# EAGLE design saa1064 (EAGLE 6.2)
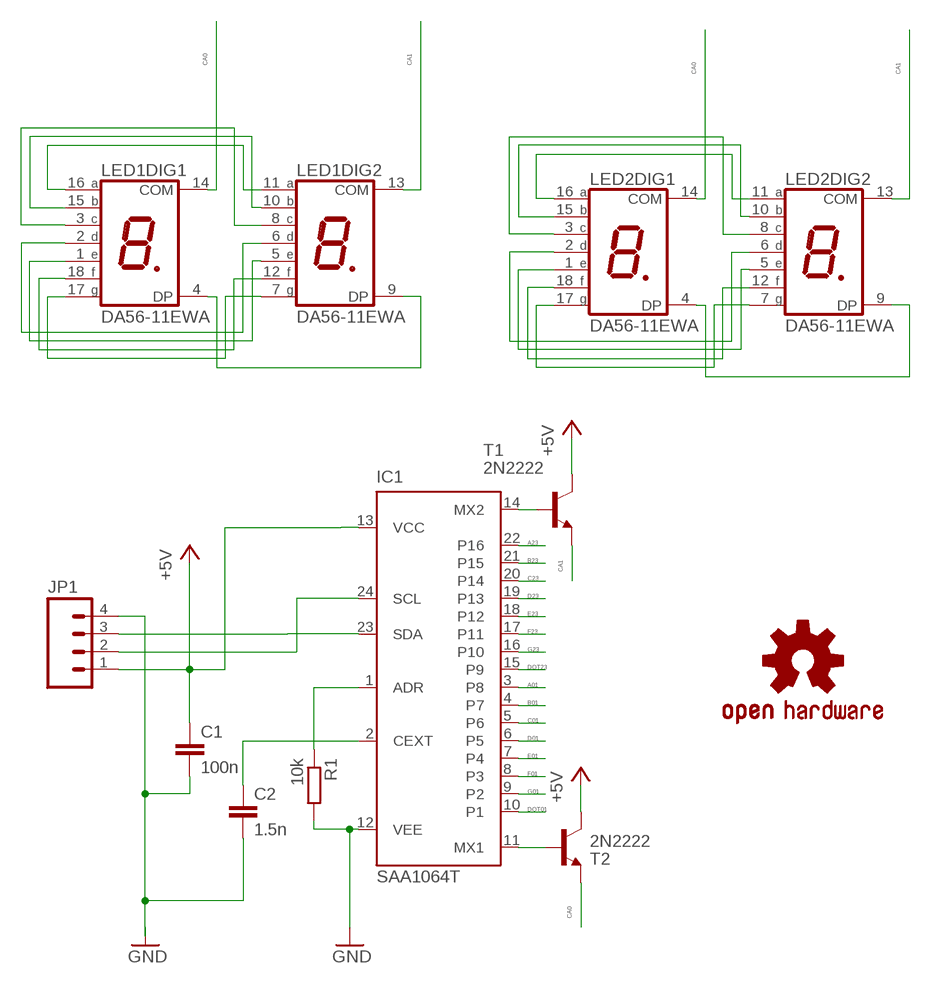
[diagram p0: schematic, sheet 1]

## Parts
C1  100n  C-EUC0805K  [C0805K]
C2  1.5n  C-EUC0805K  [C0805K]
IC1  SAA1064T  [SO24]
JP1  M04LONGPADS  [1X04_LONGPADS]
LED1  DA56-11EWA  [DA56]
LED2  DA56-11EWA  [DA56]
R1  10k  R-EU_M0805  [M0805]
T1  2N2222  [TO92-EBC-OVAL]
T2  2N2222  [TO92-EBC-OVAL]
U$1  OSHW-LOGOS  [OSHW-LOGO-S]

## Nets
+5V: C1.1 IC1.13(VCC) JP1.1 T1.C T2.C
A01: IC1.3(P8) LED1.11(DIG2:A) LED1.16(DIG1:A)
A23: IC1.22(P16) LED2.11(DIG2:A) LED2.16(DIG1:A)
B01: IC1.4(P7) LED1.10(DIG2:B) LED1.15(DIG1:B)
B23: IC1.21(P15) LED2.10(DIG2:B) LED2.15(DIG1:B)
C01: IC1.5(P6) LED1.3(DIG1:C) LED1.8(DIG2:C)
C23: IC1.20(P14) LED2.3(DIG1:C) LED2.8(DIG2:C)
CA0: LED1.14(DIG1:COM) LED2.14(DIG1:COM) T2.E
CA1: LED1.13(DIG2:COM) LED2.13(DIG2:COM) T1.E
D01: IC1.6(P5) LED1.2(DIG1:D) LED1.6(DIG2:D)
D23: IC1.19(P13) LED2.2(DIG1:D) LED2.6(DIG2:D)
DOT01: IC1.10(P1) LED1.4(DIG1:DP) LED1.9(DIG2:DP)
DOT23: IC1.15(P9) LED2.4(DIG1:DP) LED2.9(DIG2:DP)
E01: IC1.7(P4) LED1.1(DIG1:E) LED1.5(DIG2:E)
E23: IC1.18(P12) LED2.1(DIG1:E) LED2.5(DIG2:E)
F01: IC1.8(P3) LED1.12(DIG2:F) LED1.18(DIG1:F)
F23: IC1.17(P11) LED2.12(DIG2:F) LED2.18(DIG1:F)
G01: IC1.9(P2) LED1.7(DIG2:G) LED1.17(DIG1:G)
G23: IC1.16(P10) LED2.7(DIG2:G) LED2.17(DIG1:G)
GND: C1.2 C2.2 IC1.12(VEE) JP1.4 R1.2
N$1: IC1.1(ADR) R1.1
N$2: C2.1 IC1.2(CEXT)
N$15: IC1.11(MX1) T2.B
N$16: IC1.14(MX2) T1.B
SCL: IC1.24(SCL) JP1.2
SDA: IC1.23(SDA) JP1.3

## Library data of the parts
C1 C2 = resistor:C-EU: CAPACITOR, European symbol
IC1 = micro-philips:SAA1064: I2C-Bus 4-digit LED-DRIVER; MPN: SAA1064T/N2,118; OC_FARNELL: unknown; OC_NEWARK: 70R8648
JP1 = SparkFun:M04: Header 4 Standard 4-pin 0.1" header. Use with straight break away headers (SKU : PRT-00116), right angle break away headers (PRT-00553), swiss pins (PRT-00743), machine pins (PRT-00117), and female headers (PRT-00115). Molex polarized connector foot print use with SKU : PRT-08231 with associated crimp pins and housings. 1MM SMD Version SKU: PRT-10208
LED1 LED2 = display-kingbright:DA56-11: 14.22mm (0.56INCH) DUAL DIGIT NUMERIC DISPLAYS Source: www.kingbright.com .. DA56-11SRWA.pdf; OC_FARNELL: unknown; OC_NEWARK: unknown
R1 = resistor:R-EU_: RESISTOR, European symbol
T1 T2 = adafruit:2N2222: NPN TRANSISTOR Big oval pads
U$1 = SparkFun:OSHW-LOGO: Open Source Hardware Logo This logo indicates the piece of hardware it is found on incorporates a OSHW license and/or adheres to the definition of open source hardware found here: http://freedomdefined.org/OSHW

## Board
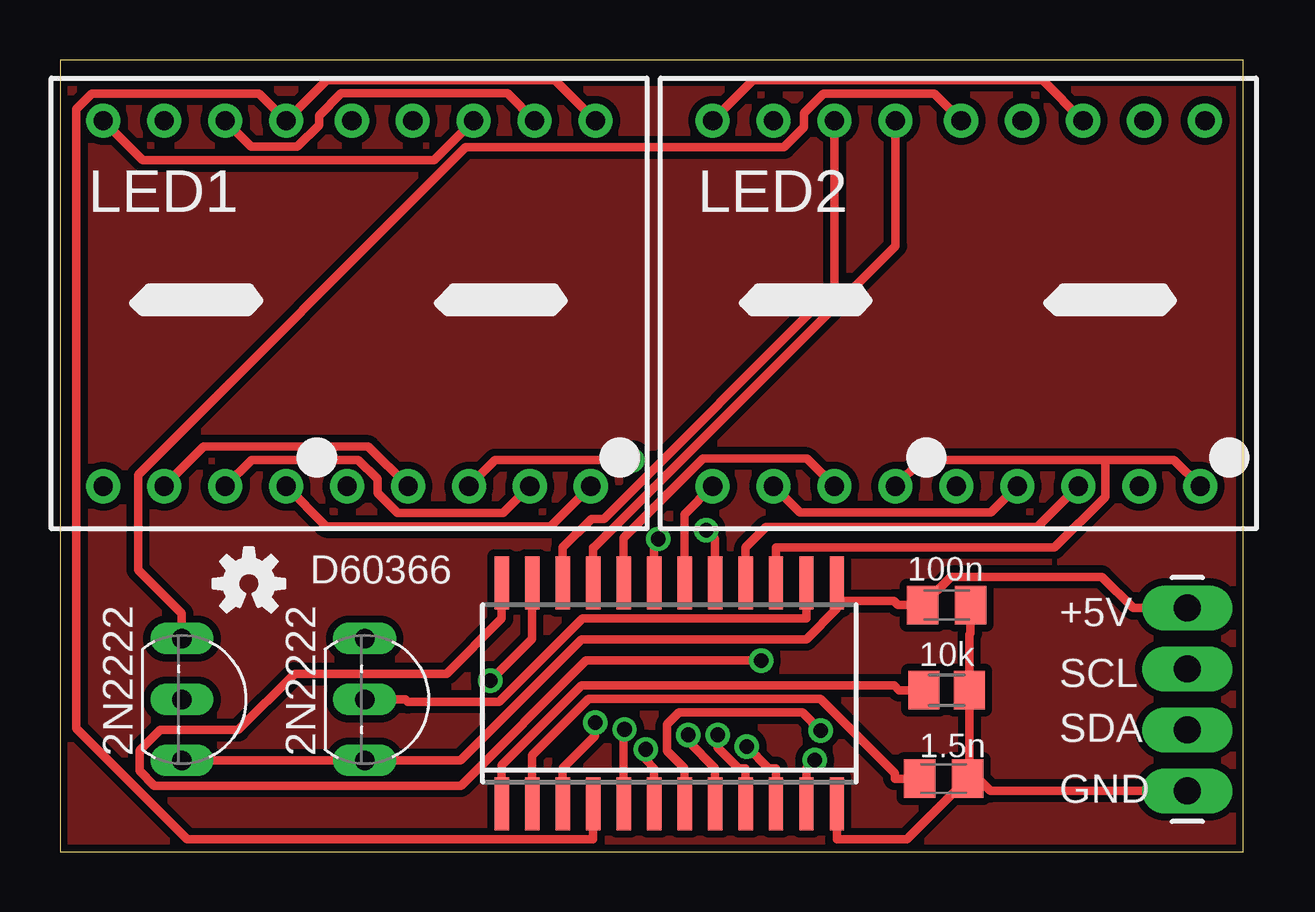
[diagram p1: board, top side]
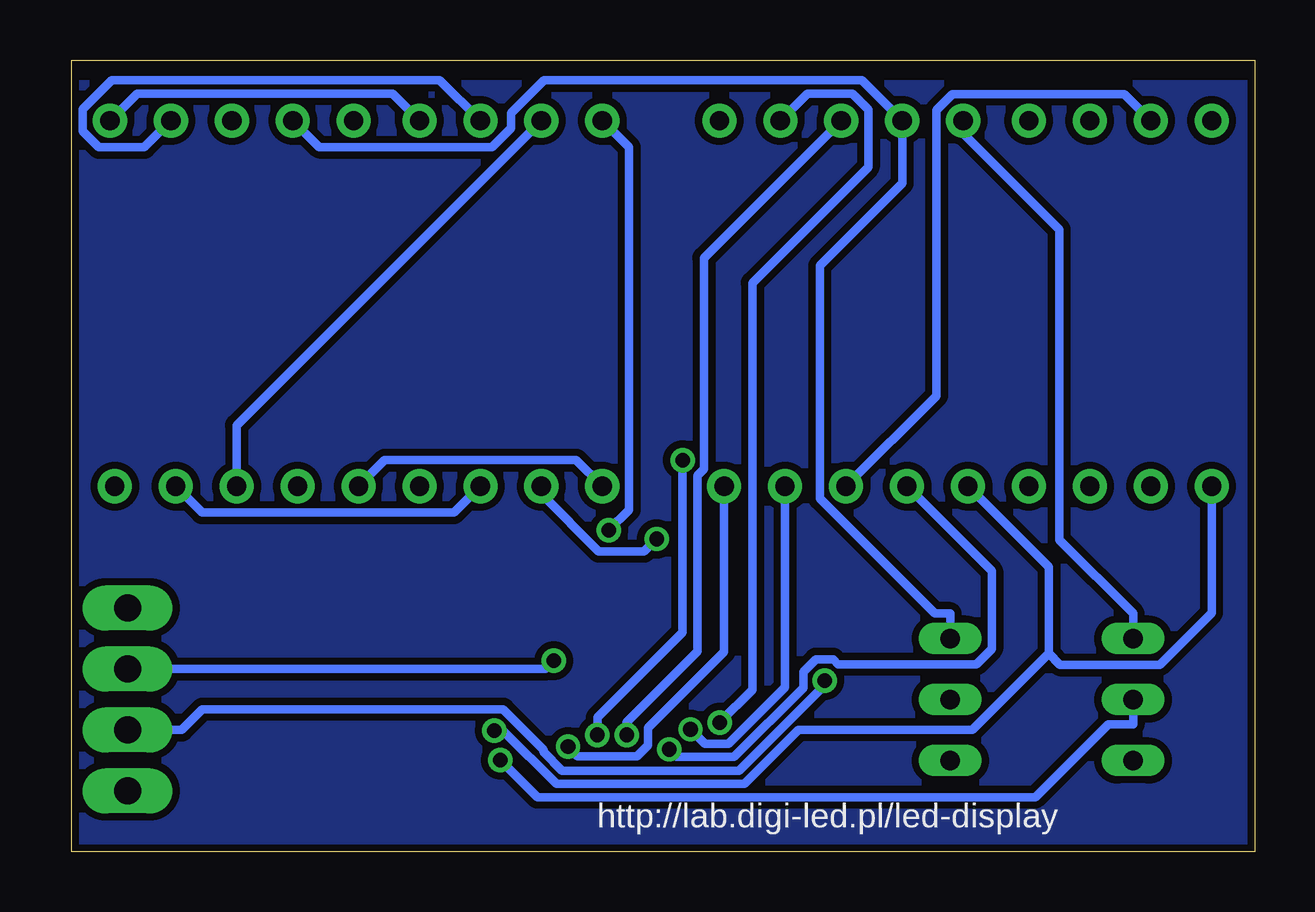
[diagram p2: board, bottom side, seen from below]

Size 49.33 x 33.01 mm. Coordinates in mm from the lower left corner, seen from the top.
Outline: 0,0 49.33,0 49.33,33.01 0,33.01 0,0
Copper layers (1*16): Top 0.035mm / dielectric 1.5mm / Bottom 0.035mm
Design rules: minimum track width 6mil, minimum drill 12mil, track to track 6mil, track to pad 6mil, pad to pad 6mil, via to via 6mil, smd to smd 0mil, copper to edge 10mil, drill to drill 10mil, minimum pad ring 10mil, minimum via ring 6mil, stop-mask expansion 2mil, vias tented up to drill 100mil, thermal gap 10mil

### Footprints (pad centres in the part's own frame; a part is rotated, then mirrored left to right if it is on the bottom)
C0805K = smd 1.3 x 1.6: 1 -1,0; 2 1,0
SO24 = smd 0.6 x 2.2: 1 -6.985,-4.6; 2 -5.715,-4.6; 3 -4.445,-4.6; 4 -3.175,-4.6; 5 -1.905,-4.6; 6 -0.635,-4.6; 7 0.635,-4.6; 8 1.905,-4.6; 9 3.175,-4.6; 10 4.445,-4.6; 11 5.715,-4.6; 12 6.985,-4.6; 13 6.985,4.6; 14 5.715,4.6; 15 4.445,4.6; 16 3.175,4.6; 17 1.905,4.6; 18 0.635,4.6; 19 -0.635,4.6; 20 -1.905,4.6; 21 -3.175,4.6; 22 -4.445,4.6; 23 -5.715,4.6; 24 -6.985,4.6
1X04_LONGPADS = drill 1.118 pad 1.88 long: 1 0,0; 2 2.54,0; 3 5.08,0; 4 7.62,0
DA56 = drill 0.8 pad 1.422: 1 -10.26,-7.62; 2 -7.72,-7.62; 3 -5.18,-7.62; 4 -2.64,-7.62; 5 -0.1,-7.62; 6 2.44,-7.62; 7 4.98,-7.62; 8 7.52,-7.62; 9 10.06,-7.62; 10 10.26,7.62; 11 7.72,7.62; 12 5.18,7.62; 13 2.64,7.62; 14 0.1,7.62; 15 -2.64,7.62; 16 -5.18,7.62; 17 -7.72,7.62; 18 -10.26,7.62
M0805 = smd 1.3 x 1.6: 1 -0.95,0; 2 0.95,0
TO92-EBC-OVAL = drill 0.813 long: B 0,-1.27; C 2.54,-1.27; E -2.54,-1.27

### Placement (x,y rotation side)
C1  36.96,10.29 0 top
C2  36.83,3.05 0 top
IC1  25.4,6.6 0 top
JP1  46.99,10.16 270 top
LED1  12.06,22.86 0 top
LED2  37.47,22.86 0 top
R1  36.96,6.73 0 top
T1  13.97,6.35 270 top
T2  6.35,6.35 270 top
U$1  7.87,11.18 0 top

### Tracks (layer width: path | path; a pad name or v marks a point on that pad's centre or on a via)
+5V
  Top 0.35: 32.38,10.46 32.38,10.14 31.11,8.86 21.75,8.86 16.7,3.81 14.4,3.81 T1.C T2.C | JP1.1 44.73,10.16 43.43,11.46 37.13,11.46 C1.1 34.93,10.29 34.75,10.46 32.38,10.46 | IC1.13 32.38,10.46
A01  (via drill 0.61 pad 1.02)
  Top 0.35: LED1.16 7.97,29.39 9.89,29.39 10.79,30.3 10.79,30.68 11.73,31.61 18.65,31.61 LED1.11 | v22.31,5.39 22.31,4.84 20.95,3.48 IC1.3
  Bottom 0.35: LED1.11 18.66,31.61 16.79,31.61 16.11,30.93 16.11,28.54 20.95,23.71 20.95,6.75 v22.31,5.39
A23
  Top 0.35: IC1.22 20.95,12.68 22.15,13.88 22.67,13.88 32.28,23.5 LED2.16
  Bottom 0.35: LED2.16 33.98,32.17 47.65,32.17 48.86,30.96 48.86,30.05 48.19,29.37 46.29,29.37 LED2.11
B01
  Top 0.35: LED1.10 20.64,32.17 11.11,32.17 LED1.15 8.31,31.59 1.32,31.59 0.69,30.96 0.69,5.15 5.31,0.53 22.23,0.53 IC1.4
B23
  Top 0.35: LED2.15 34.83,25.25 22.25,12.68 22.23,12.68 IC1.21
  Bottom 0.35: LED2.15 35.95,31.61 46.6,31.61 LED2.10
C01  (via drill 0.61 pad 1.02)
  Top 0.35: v23.53,5.1 23.5,5.07 23.5,3.48 IC1.5 | LED1.8 18.46,14.12 14.07,14.12 13.23,14.95 13.23,15.53 12.43,16.34 7.98,16.34 LED1.3
  Bottom 0.35: LED1.8 19.59,6.86 21.94,4.5 22.93,4.5 v23.53,5.1
C23
  Top 0.35: LED2.3 31.13,16.39 26.8,16.39 23.5,13.09 IC1.20
  Bottom 0.35: LED2.8 43.89,14.14 33.38,14.14 LED2.3
CA0
  Top 0.35: T2.E 5.08,9.93 3.25,11.75 3.25,15.71 16.91,29.37 30.18,29.37 31.02,30.2 31.02,30.8 31.82,31.61 36.44,31.61 LED2.14
  Bottom 0.35: LED1.14 12.16,29.95 8.15,25.95 8.15,13 5.08,9.93 T2.E
CA1
  Bottom 0.35: T1.E 12.7,9.93 13.35,9.93 18.14,14.72 18.14,24.43 14.71,27.87 LED1.13 16.38,32.16 29.64,32.16 31.02,30.78 31.02,30.17 31.81,29.38 39,29.38 LED2.13
D01  (via drill 0.61 pad 1.02)
  Top 0.35: v24.42,4.27 24.42,3.83 24.77,3.48 IC1.6 | LED1.6 12.85,16.89 6,16.89 LED1.2
  Bottom 0.35: LED1.6 10.97,11.7 10.97,8.46 11.61,7.82 17.37,7.82 17.57,8.02 18.31,8.02 18.83,7.5 18.83,6.84 21.71,3.95 24.1,3.95 v24.42,4.27
D23  (via drill 0.61 pad 1.02)
  Top 0.35: LED2.6 38.8,14.14 30.85,14.14 LED2.2 | IC1.19 24.77,12.87 v24.94,13.04
  Bottom 0.35: v24.94,13.04 25.46,12.52 27.35,12.52 29.75,14.92 LED2.2
DOT01  (via drill 0.61 pad 1.02)
  Top 0.35: IC1.10 29.84,3.48 29.54,3.48 v28.63,4.39 | LED1.4 11.1,13.56 20.45,13.56 LED1.9
  Bottom 0.35: v28.63,4.39 28.23,3.99 25.76,3.99 25.3,4.44 25.3,5.16 22.12,8.34 LED1.9
DOT23
  Top 0.35: 43.57,16.34 35.92,16.34 LED2.4 | LED2.9 46.43,16.34 43.57,16.34 | 43.57,16.34 43.57,14.8 41.46,12.68 29.84,12.68 IC1.15
E01  (via drill 0.61 pad 1.02)
  Top 0.35: v31.71,5.05 30.95,5.81 25.81,5.81 25.3,5.3 25.3,4.21 26.04,3.48 IC1.7
  Bottom 0.35: 8.6,8.27 11.79,5.08 19.02,5.08 21.27,2.83 29.11,2.83 31.33,5.05 v31.71,5.05 | LED1.5 8.6,11.87 8.6,8.27 | 8.6,8.27 8.13,7.8 3.97,7.8 1.8,9.96 LED1.1
E23
  Top 0.35: LED2.1 26.04,14.07 26.04,12.68 IC1.18
  Bottom 0.35: LED2.5 36.27,16.33 28.3,16.33 LED2.1
F01  (via drill 0.61 pad 1.02)
  Top 0.35: LED1.18 3.45,28.84 15.6,28.84 LED1.12 | v26.19,4.87 26.19,4.6 27.3,3.48 IC1.8
  Bottom 0.35: LED1.12 22.97,24.75 22.97,15.96 23.24,15.69 23.24,8.36 26.19,5.41 v26.19,4.87
F23  (via drill 0.61 pad 1.02)
  Top 0.35: v26.93,13.41 27.3,13.04 IC1.17 | LED2.12 40.97,32.16 28.88,32.16 LED2.18
  Bottom 0.35: LED2.18 26.09,29.36 26.09,14.26 v26.93,13.41
G01  (via drill 0.61 pad 1.02)
  Top 0.35: v27.41,4.87 27.41,4.35 28.28,3.48 28.57,3.48 IC1.9 | LED1.7 18.13,16.33 v23.86,16.33
  Bottom 0.35: v23.86,16.33 23.86,9.15 27.41,5.59 v27.41,4.87 | LED1.17 5.44,31.58 12.62,31.58 13.28,30.92 13.28,19.01 LED1.7
G23
  Top 0.35: IC1.16 28.57,12.68 29.43,13.54 40.74,13.54 LED2.7
  Bottom 0.35: LED2.17 42.45,17.78 LED2.7
GND
  Top 0.35: IC1.12 32.38,0.53 35.31,0.53 C2.2 38.05,3.27 | 38.05,3.27 38.77,2.54 44.73,2.54 JP1.4 | 38.05,3.27 37.91,3.41 R1.2 37.91,9.06 37.96,9.11 C1.2
N$1
  Top 0.35: R1.1 34.98,6.73 34.78,6.93 21.75,6.93 18.41,3.6 18.41,3.48 IC1.1
N$2
  Top 0.35: C2.1 34.8,3.05 34.8,3.28 31.7,6.38 22.04,6.38 19.68,4.02 19.68,3.48 IC1.2
N$3
  pour Top (isolate 0.3): 0.25,31.75 0.25,0.25 49.02,0.25 49.02,31.75
N$4
  pour Bottom (isolate 0.3): 0,32 0,0.25 49.02,0.25 49.02,32
N$15  (via drill 0.61 pad 1.02)
  Top 0.35: v31.46,3.82 31.11,3.48 IC1.11
  Bottom 0.35: v31.46,3.82 29.91,2.28 9.15,2.28 6.12,5.31 5.08,5.31 T2.B
N$16
  Top 0.35: T1.B 14.4,6.35 14.5,6.25 18.31,6.25 21.79,9.73 31.11,9.73 IC1.14
SCL  (via drill 0.61 pad 1.02)
  Top 0.35: IC1.24 18.41,9.73 16.11,7.42 9.78,7.42 7.43,5.08 4.17,5.08 3.32,4.23 3.32,3.37 3.93,2.75 16.71,2.75 21.93,7.97 v29.23,7.97
  Bottom 0.35: JP1.2 29.58,7.62 v29.23,7.97
SDA  (via drill 0.61 pad 1.02)
  Top 0.35: v17.94,7.14 19.68,8.88 IC1.23
  Bottom 0.35: v17.94,7.14 17.94,6.94 21.5,3.38 28.88,3.38 29.66,4.16 29.66,4.26 31.34,5.94 43.87,5.94 44.73,5.08 JP1.3

### Text on the board
tNames: D60366 | +5V | SCL | SDA | GND
bNames: http://lab.digi-led.pl/led-display